# Altium schematic sheet [03].MCU.SchDoc
size A4; Organization: Altium Limited; Address1: L3, 12a Rodborough Rd; Address2: Frenchs Forest; Address3: NSW; Address4: Australia 2086
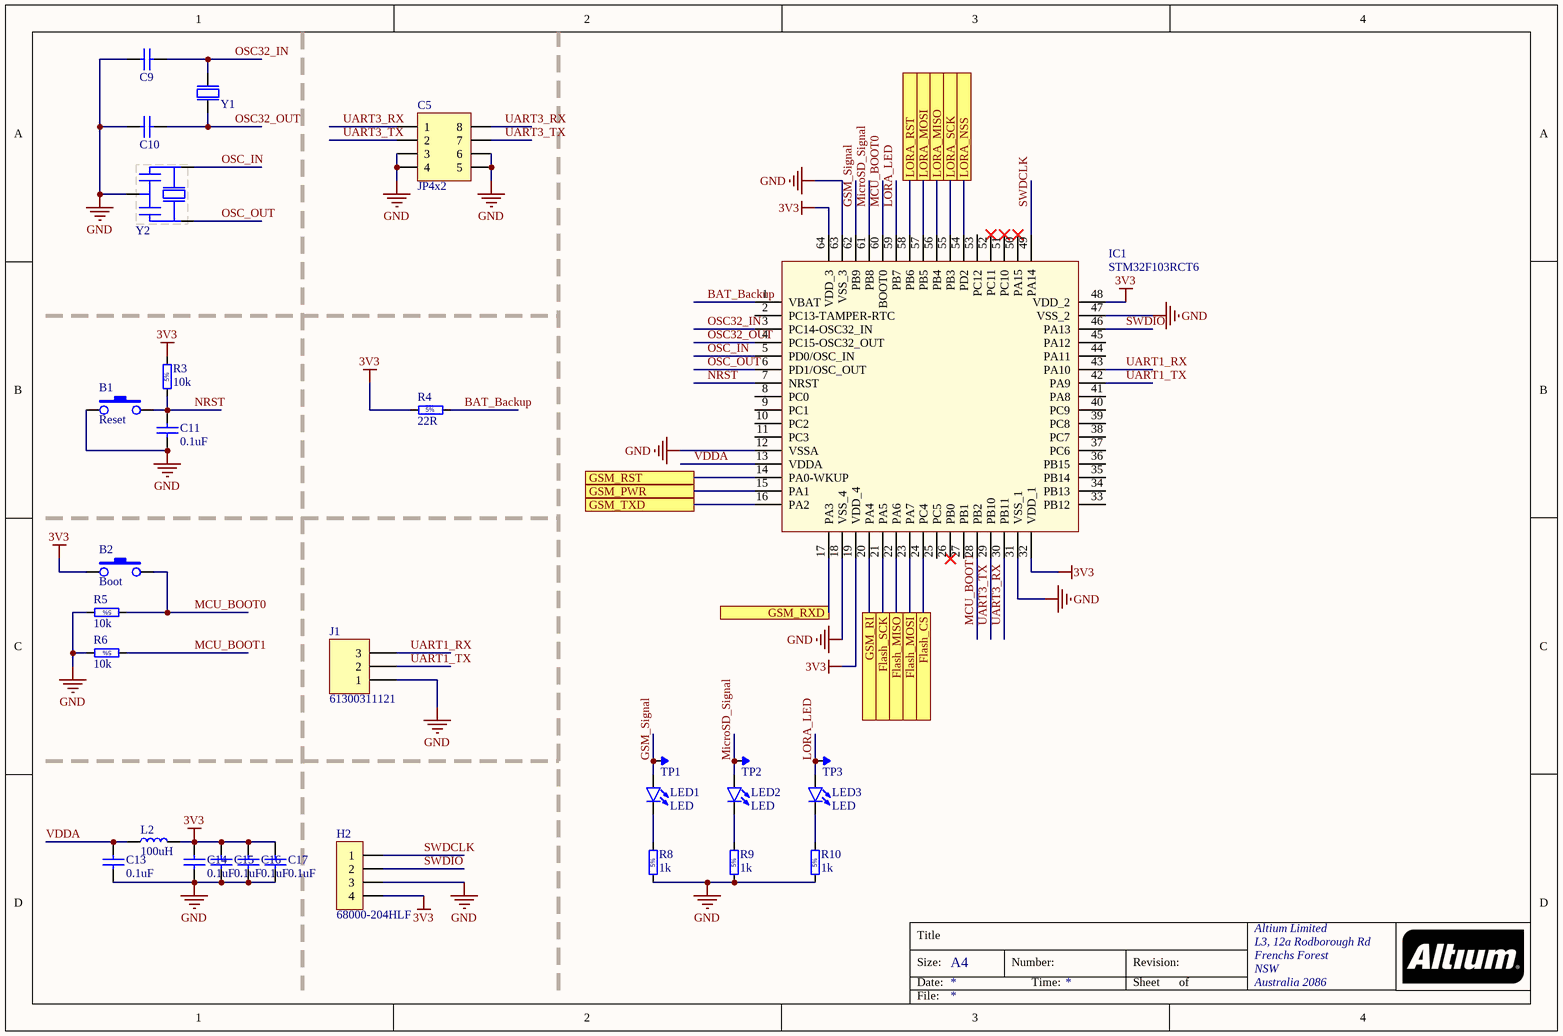
[diagram p0: [03].MCU.SchDoc]

## Parts
B1  Reset  [TACTILE-SWITCH-1101NE]
B2  Boot  [TACTILE-SWITCH-1101NE]
C5  JP4x2  [JP4-D2T]
C9  10pF  [C_0603]  (value not drawn)
C10  10pF  [C_0603]  (value not drawn)
C11  0.1uF  [C_0603]
C13  0.1uF  [C_0603]
C14  0.1uF  [C_0603]
C15  0.1uF  [C_0603]
C16  0.1uF  [C_0603]
C17  0.1uF  [C_0603]
H2  68000-204HLF  [HDR1X4]
IC1  STM32F103RCT6  [QFP50P1000X1000X160-64N]
J1  61300311121  [HDR1X3]
L2  100uH  [Inductor_0805]
LED1  LED  [LED_0805]
LED2  LED  [LED_0805]
LED3  LED  [LED_0805]
R3  10k  [R_0603]
R4  22R  [R_0603]
R5  10k  [R_0603]
R6  10k  [R_0603]
R8  1k  [R_0603]
R9  1k  [R_0603]
R10  1k  [R_0603]
TP1  TESTPOINT  [TP-R40]  (value not drawn)
TP2  TESTPOINT  [TP-R40]  (value not drawn)
TP3  TESTPOINT  [TP-R40]  (value not drawn)
Y1  FC-135 32.7680KA-A0  [Crystal_2P]  (value not drawn)
Y2  CSTCE8M00G52-R0  [Crystal_4P]  (value not drawn)

## Ports
Flash_CS, Flash_MISO, Flash_MOSI, Flash_SCK, GSM_PWR, GSM_RI, GSM_RST, GSM_RXD, GSM_TXD, LORA_MISO, LORA_MOSI, LORA_NSS, LORA_RST, LORA_SCK

## Nets
3V3: B2.1 C14.2 C15.2 C16.2 C17.2 H2.4 IC1.19(VDD_4) IC1.32(VDD_1) IC1.48(VDD_2) IC1.64(VDD_3) L2.2 R3.2 R4.1
GND: B1.1 C5.3 C5.4 C5.5 C5.6 C9.1 C10.1 C11.1 C13.1 C14.1 C15.1 C16.1 C17.1 H2.3 IC1.12(VSSA) IC1.18(VSS_4) IC1.31(VSS_1) IC1.47(VSS_2) IC1.63(VSS_3) J1.1 R5.2 R6.2 R8.1 R9.1 R10.1 Y2.2
BAT_Backup: IC1.1(VBAT) R4.2
Flash_CS: IC1.24(PC4) ; port Flash_CS
Flash_MISO: IC1.22(PA6) ; port Flash_MISO
Flash_MOSI: IC1.23(PA7) ; port Flash_MOSI
Flash_SCK: IC1.21(PA5) ; port Flash_SCK
GSM_PWR: IC1.15(PA1) ; port GSM_PWR
GSM_RI: IC1.20(PA4) ; port GSM_RI
GSM_RST: IC1.14(PA0-WKUP) ; port GSM_RST
GSM_RXD: IC1.17(PA3) ; port GSM_RXD
GSM_Signal: IC1.62(PB9) LED1.A TP1.1
GSM_TXD: IC1.16(PA2) ; port GSM_TXD
LORA_LED: IC1.59(PB7) LED3.A TP3.1
LORA_MISO: IC1.56(PB4) ; port LORA_MISO
LORA_MOSI: IC1.57(PB5) ; port LORA_MOSI
LORA_NSS: IC1.54(PD2) ; port LORA_NSS
LORA_RST: IC1.58(PB6) ; port LORA_RST
LORA_SCK: IC1.55(PB3) ; port LORA_SCK
MCU_BOOT0: B2.2 IC1.60(BOOT0) R5.1
MCU_BOOT1: IC1.28(PB2) R6.1
MicroSD_Signal: IC1.61(PB8) LED2.A TP2.1
NRST: B1.2 C11.2 IC1.7(NRST) R3.1
OSC32_IN: C9.2 IC1.3(PC14-OSC32_IN) Y1.2
OSC32_OUT: C10.2 IC1.4(PC15-OSC32_OUT) Y1.1
OSC_IN: IC1.5(PD0/OSC_IN) Y2.1
OSC_OUT: IC1.6(PD1/OSC_OUT) Y2.3
SWDCLK: H2.1 IC1.49(PA14)
SWDIO: H2.2 IC1.46(PA13)
UART1_RX: IC1.43(PA10) J1.3
UART1_TX: IC1.42(PA9) J1.2
UART3_RX: C5.1 C5.8 IC1.30(PB11)
UART3_TX: C5.2 C5.7 IC1.29(PB10)
VDDA: C13.2 IC1.13(VDDA) L2.1
NetLED1_K: LED1.K R8.2
NetLED2_K: LED2.K R9.2
NetLED3_K: LED3.K R10.2

Not connected (* = marked no-connect by the designer): IC1 2(PC13-TAMPER-RTC) 8(PC0) 9(PC1) 10(PC2) 11(PC3) 25(PC5) 26(PB0)* 27(PB1) 33(PB12) 34(PB13) 35(PB14) 36(PB15) 37(PC6) 38(PC7) 39(PC8) 40(PC9) 41(PA8) 44(PA11) 45(PA12) 50(PA15)* 51(PC10)* 52(PC11)* 53(PC12)

## Notes on the sheet
- Title
- Size:
- Date:
- A4
- Number:
- Time:
- Revision:
- Sheet
- of
- File:
- (in symbol RC0805FR-0710KL) 5%
- (in symbol RC0805FR-0722RL) 5%
- (in symbol RC0805JR-071KL) 5%

## Library data of the parts
B1 B2 = Button_2P_SMD
C5 = JP4x2: WR-PHD 2.54 mm Dual Socket Header; Manufacturer: W¨¹rth Elektronik eiSos GmbH; partNo: 61300821821; ComponentLink1 Description: Manufacturer; ComponentLink2 Description: Datasheet; NoPins: 08; Created Date: 29 March 2013; ComponentLink1URL: http://www.we-online.com; ComponentLink2URL: http://katalog.we-online.de/em/datasheet/6130xx21821.pdf; Created by: Karrer Zheng
C9 C10 = VJ0805A100JXJPW1BC: Non-polarised capacitor; Part Description: SMD Multilayer Chip Ceramic Capacitor; Manufacturer: Vishay; ID: 3; Voltage: 16VDC; TC: NP0; Tolerance: 5%; Part Number: VJ0805A100JXJPW1BC; Component Kind: Standard; Component Type: Standard; Footprint: CAPC2012X135N; Pin Count: 2; Value: 10pF; Status: Not Recommended; Manufacturer Part Number: VJ0805A100JXJPW1BC; Case: 0805; Mounted: Yes; Socket: No; SMD: Yes; ComponentHeigh: https://www.mouser.vn; Manufacturer1 Example: MDBK
C11 C13-C17 = VJ0805Y104KXXMC: Non-polarised capacitor; Part Description: SMD Multilayer Chip Ceramic Capacitor; Manufacturer: Vishay; ID: 4; Voltage: 25VDC; TC: X7R; Tolerance: 10%; Part Number: VJ0805Y104KXXMC; Component Kind: Standard; Component Type: Standard; Footprint: CAPC2012X135N; Pin Count: 2; Value: 0.1uF; Status: Not Recommended; Manufacturer Part Number: VJ0805Y104KXXMC; Case: 0805; Mounted: Yes; Socket: No; SMD: Yes; ComponentHeigh: https://www.mouser.vn; Manufacturer1 Example: MDBK
H2 = 68000-204HLF: CONN HEADER 4POS .100 STR 15AU; Manufacturer: Amphenol FCI; ID: 7; Detailed Description: 4 Positions Header Connector 0.100" (2.54mm) Through Hole Gold or Gold, GXT™; Part Number: 68000-204HLF; Device: 68000-204HLF; Component Kind: Standard; Component Type: Standard; Manufacturer Part Number: 68000-204HLF; Pin Count: 4; Mounted: Yes; Socket: No; SMD: No; HelpURL: https://www.mouser.vn; Author: MDBK
IC1 = STM32F103RCT6: ARM Microcontrollers - MCU 32BIT Cortex M3 H/D 256 to 512 USB/CAN; Part Description: 32 bit;72 MHz;256 kB;48 kB;12bit;51 I/O; Manufacturer: STMicroelectronics; ID: 1; Part Number: STM32F103RCT6; Device: STM32F103RCT6; Component Kind: Standard; Component Type: Standard; Footprint: LQFP-64; PackageDescription: ARM Microcontrollers - MCU 32BIT Cortex M3 H/D 256 to 512 USB/CAN; Manufacturer Part Number: STM32F103RCT6; Pin Count: 64; Case: LQFP-64; Mounted: Yes; Socket: No; SMD: Yes; ComponentHeight: 1.0mm; HelpURL: https://www.mouser.vn; Author: MDBK; CreateDate: 11/18/2009; LatestRevisionDate: 1/24/2011
J1 = 61300311121: CONN HEADER 3 POS 2.54; Manufacturer: Wurth Electronics Inc.; ID: 8; Detailed Description: 3 Positions Header Connector 0.100" (2.54mm) Through Hole Gold; Part Number: 61300311121; Device: 61300311121; Component Kind: Standard; Component Type: Standard; Manufacturer Part Number: 61300311121; Pin Count: 3; Mounted: Yes; Socket: No; SMD: No; HelpURL: https://www.mouser.vn; Author: MDBK
L2 = LB2016T101M: FIXED IND 100UH 80MA 5.5 OHM SMD; Manufacturer: Taiyo Yuden; ID: 7; Detailed Description: 100µH Shielded Wirewound Inductor 80mA 5.5 Ohm 0603 (1608 Metric); Part Number: LB2016T101M; Value: 100uH; Component Kind: Standard; Component Type: Standard; Footprint: 0805(2016 Metric); Manufacturer Part Number: LB2016T101M; Pin Count: 2; Case: 0805(2016 Metric); Mounted: Yes; Socket: No; SMD: Yes; HelpURL: https://www.mouser.vn; Author: MDBK
LED1-LED3 = LED_0805
R3 R5 R6 = RC0805FR-0710KL: Resistor - 5%; Part Description: General Purpose Chip Resistor; Manufacturer: Yageo; ID: 1; Power: 125 mW (1/8 W); TC: 100 PPM / C; Part Number: RC0805FR-0710KL; Component Kind: Standard; Component Type: Standard; Footprint: RESC2012X60N; Pin Count: 2; Value: 10k; Status: Not recommended; Tolerance: ±5%; Manufacturer Part Number: RC0805FR-0710KL; Case: 0805; Mounted: Yes; Socket: No; SMD: Yes; Author: MDBK
R4 = RC0805FR-0722RL: Resistor - 5%; Part Description: General Purpose Chip Resistor; Manufacturer: Yageo; ID: 5; Power: 125 mW (1/8 W); TC: 100 PPM / C; Part Number: RC0805FR-0722RL; Value: 22R; Component Kind: Standard; Component Type: Standard; Footprint: RESC2012X60N; Pin Count: 2; Status: Not recommended; Tolerance: ±5%; Manufacturer Part Number: RC0805FR-0722RL; Case: 0805; Mounted: Yes; Socket: No; SMD: Yes; Author: MDBK
R8-R10 = RC0805JR-071KL: Resistor - 5%; Part Description: General Purpose Chip Resistor; Manufacturer: Yageo; ID: 2; Power: 125 mW (1/8 W); TC: 100 PPM / C; Part Number: RC0805JR-071KL; Value: 1k; Component Kind: Standard; Component Type: Standard; Footprint: RESC2012X60N; Pin Count: 2; Status: Not recommended; Tolerance: ±5%; Manufacturer Part Number: RC0805JR-071KL; Case: 0805; Mounted: Yes; Socket: No; SMD: Yes; Author: MDBK
Y1 = FC-135 32.7680KA-A0: CRYSTAL 32.7680KHZ 12.5PF SMT; Manufacturer: EPSON; ID: 2; Detailed Description: 32.768kHz ±20ppm Crystal 12.5pF 70 kOhms 2-SMD, No Lead; Part Number: FC-135 32.7680KA-A0; Component Kind: Standard; Component Type: Standard; Device: FC-135 32.7680KA-A0; Footprint: 2-SMD, No Lead; Manufacturer Part Number: FC-135 32.7680KA-A0; Pin Count: 2; Case: 2-SMD, No Lead; Mounted: Yes; Socket: No; SMD: Yes; HelpURL: https://www.mouser.vn; Author: MDBK
Y2 = CSTCE8M00G52-R0: CER RES 8.0000MHZ 10PF SMD; Manufacturer: Murata Electronics North America; ID: 1; Detailed Description: 8MHz Ceramic Resonator Built in Capacitor 10pF ±0.2%  -20°C ~ 80°C Surface Mount; Part Number: CSTCE8M00G52-R0; Component Kind: Standard; Component Type: Standard; Device: CSTCE8M00G52-R0; Footprint: 1206 (3216 Metric); Manufacturer Part Number: CSTCE8M00G52-R0; Pin Count: 3; Case: 1206 (3216 Metric); Mounted: Yes; Socket: No; SMD: Yes; HelpURL: https://www.mouser.vn; Author: MDBK